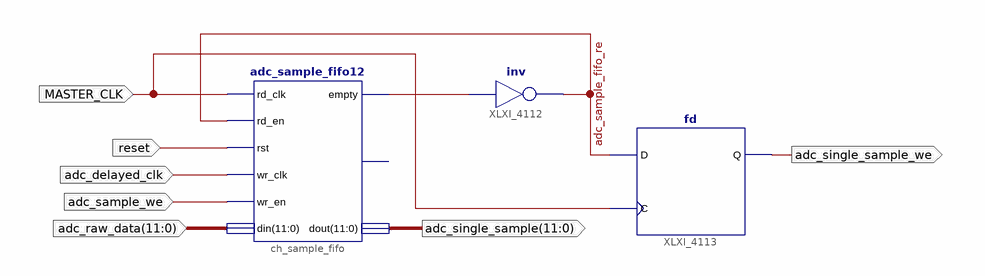
[diagram p0: schematic sheet 1]
// Xilinx ISE schematic ADC_to_MCLK_domain.sch (virtex4) as structural Verilog: 3 symbols, 7 ports
module ADC_to_MCLK_domain (
  input  adc_sample_we,
  input  [11:0] adc_raw_data,
  input  MASTER_CLK,
  input  reset,
  input  adc_delayed_clk,
  output adc_single_sample_we,
  output [11:0] adc_single_sample
);

  wire adc_sample_fifo_re, XLXN_14592;

  adc_sample_fifo12 ch_sample_fifo (
    .rd_clk(MASTER_CLK), .rd_en(adc_sample_fifo_re), .rst(reset), .wr_clk(adc_delayed_clk),
    .wr_en(adc_sample_we), .din(adc_raw_data), .empty(XLXN_14592), .dout(adc_single_sample));  // open: full
  fd XLXI_4113 (.C(MASTER_CLK), .D(adc_sample_fifo_re), .Q(adc_single_sample_we));
  not XLXI_4112 (adc_sample_fifo_re, XLXN_14592);
endmodule
